# Altium schematic sheet Switch_Matrix_CTRL.schdoc: Switch Matrix 32:2
size 420 x 297 mm; EDA_Number: ARTIQ; Projet: Switch_Matrix; Author: G.Kasprowicz; CompanyName: WUT ISE; DrawnBy: G.Kasprowicz; Organization: WUT ISE; Address1: PW ISE; Address2: Nowowiejska 15/19 00-665 Warsaw; Address3: gkasprow@gmail.com; DocumentNumber: 3; Revision: 2; SheetNumber: 3; SheetTotal: 6; ModifiedBy: -; CheckedDate: -; Title2: SPI extender; DivGrp: WUT ISE; Designer: G.Kasprowicz; ModifiedDate: -; ProjectName: Sensor Box
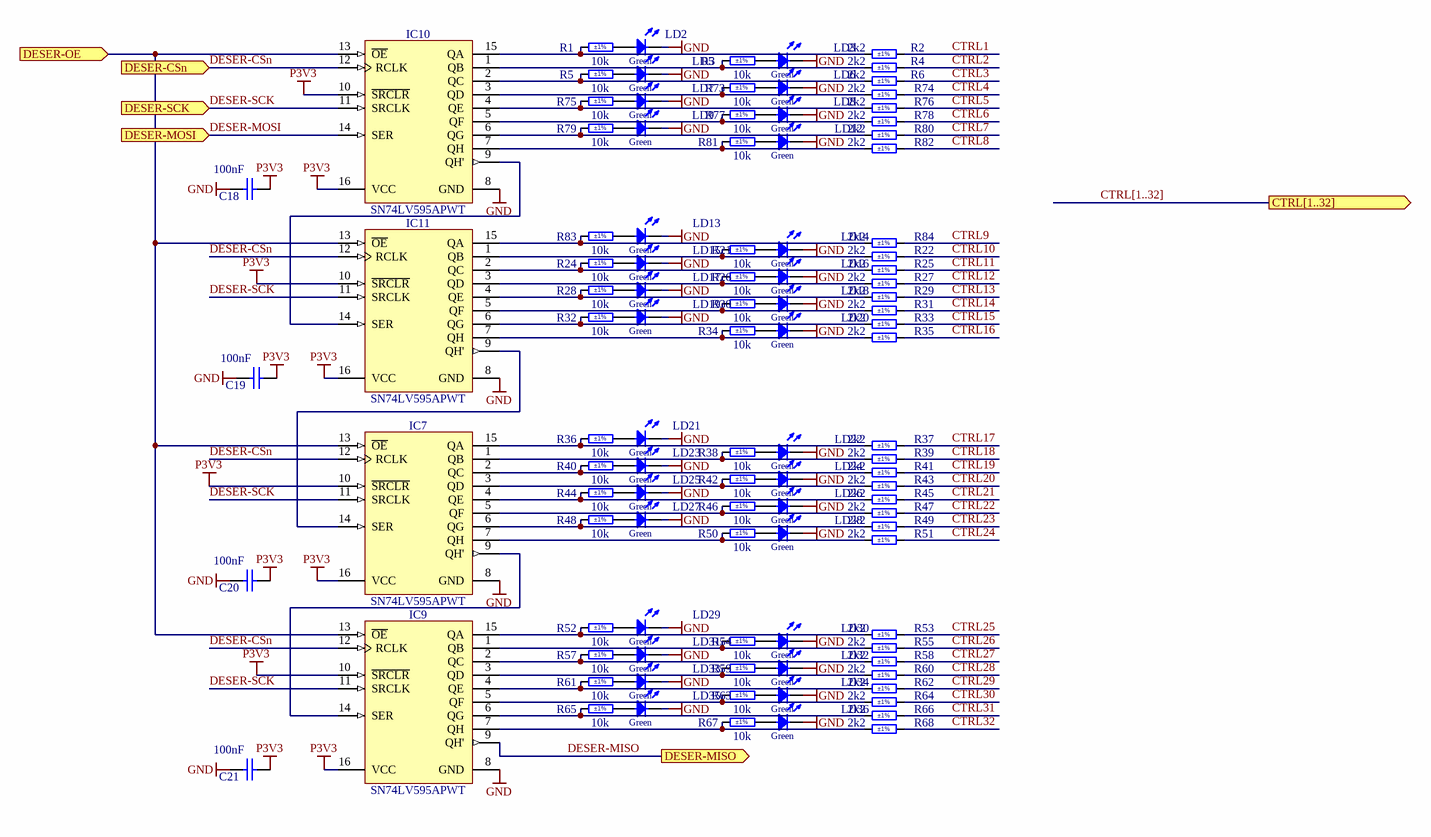
[diagram p0: Switch_Matrix_CTRL.schdoc]

## Parts
C18  100nF  [CAPC1608X87N]
C19  100nF  [CAPC1608X87N]
C20  100nF  [CAPC1608X87N]
C21  100nF  [CAPC1608X87N]
IC7  SN74LV595APWT  [SOP65P640X120-16N]
IC9  SN74LV595APWT  [SOP65P640X120-16N]
IC10  SN74LV595APWT  [SOP65P640X120-16N]
IC11  SN74LV595APWT  [SOP65P640X120-16N]
LD2  Green  [LED_KINGBRIGHT_KP-1608CGCK]
LD3  Green  [LED_KINGBRIGHT_KP-1608CGCK]
LD5  Green  [LED_KINGBRIGHT_KP-1608CGCK]
LD6  Green  [LED_KINGBRIGHT_KP-1608CGCK]
LD7  Green  [LED_KINGBRIGHT_KP-1608CGCK]
LD8  Green  [LED_KINGBRIGHT_KP-1608CGCK]
LD9  Green  [LED_KINGBRIGHT_KP-1608CGCK]
LD12  Green  [LED_KINGBRIGHT_KP-1608CGCK]
LD13  Green  [LED_KINGBRIGHT_KP-1608CGCK]
LD14  Green  [LED_KINGBRIGHT_KP-1608CGCK]
LD15  Green  [LED_KINGBRIGHT_KP-1608CGCK]
LD16  Green  [LED_KINGBRIGHT_KP-1608CGCK]
LD17  Green  [LED_KINGBRIGHT_KP-1608CGCK]
LD18  Green  [LED_KINGBRIGHT_KP-1608CGCK]
LD19  Green  [LED_KINGBRIGHT_KP-1608CGCK]
LD20  Green  [LED_KINGBRIGHT_KP-1608CGCK]
LD21  Green  [LED_KINGBRIGHT_KP-1608CGCK]
LD22  Green  [LED_KINGBRIGHT_KP-1608CGCK]
LD23  Green  [LED_KINGBRIGHT_KP-1608CGCK]
LD24  Green  [LED_KINGBRIGHT_KP-1608CGCK]
LD25  Green  [LED_KINGBRIGHT_KP-1608CGCK]
LD26  Green  [LED_KINGBRIGHT_KP-1608CGCK]
LD27  Green  [LED_KINGBRIGHT_KP-1608CGCK]
LD28  Green  [LED_KINGBRIGHT_KP-1608CGCK]
LD29  Green  [LED_KINGBRIGHT_KP-1608CGCK]
LD30  Green  [LED_KINGBRIGHT_KP-1608CGCK]
LD31  Green  [LED_KINGBRIGHT_KP-1608CGCK]
LD32  Green  [LED_KINGBRIGHT_KP-1608CGCK]
LD33  Green  [LED_KINGBRIGHT_KP-1608CGCK]
LD34  Green  [LED_KINGBRIGHT_KP-1608CGCK]
LD35  Green  [LED_KINGBRIGHT_KP-1608CGCK]
LD36  Green  [LED_KINGBRIGHT_KP-1608CGCK]
R1  10k  Tolerance: ±1%  [RESC1608X55N]
R2  2k2  Tolerance: ±1%  [RESC1608X55N]
R3  10k  Tolerance: ±1%  [RESC1608X55N]
R4  2k2  Tolerance: ±1%  [RESC1608X55N]
R5  10k  Tolerance: ±1%  [RESC1608X55N]
R6  2k2  Tolerance: ±1%  [RESC1608X55N]
R21  10k  Tolerance: ±1%  [RESC1608X55N]
R22  2k2  Tolerance: ±1%  [RESC1608X55N]
R24  10k  Tolerance: ±1%  [RESC1608X55N]
R25  2k2  Tolerance: ±1%  [RESC1608X55N]
R26  10k  Tolerance: ±1%  [RESC1608X55N]
R27  2k2  Tolerance: ±1%  [RESC1608X55N]
R28  10k  Tolerance: ±1%  [RESC1608X55N]
R29  2k2  Tolerance: ±1%  [RESC1608X55N]
R30  10k  Tolerance: ±1%  [RESC1608X55N]
R31  2k2  Tolerance: ±1%  [RESC1608X55N]
R32  10k  Tolerance: ±1%  [RESC1608X55N]
R33  2k2  Tolerance: ±1%  [RESC1608X55N]
R34  10k  Tolerance: ±1%  [RESC1608X55N]
R35  2k2  Tolerance: ±1%  [RESC1608X55N]
R36  10k  Tolerance: ±1%  [RESC1608X55N]
R37  2k2  Tolerance: ±1%  [RESC1608X55N]
R38  10k  Tolerance: ±1%  [RESC1608X55N]
R39  2k2  Tolerance: ±1%  [RESC1608X55N]
R40  10k  Tolerance: ±1%  [RESC1608X55N]
R41  2k2  Tolerance: ±1%  [RESC1608X55N]
R42  10k  Tolerance: ±1%  [RESC1608X55N]
R43  2k2  Tolerance: ±1%  [RESC1608X55N]
R44  10k  Tolerance: ±1%  [RESC1608X55N]
R45  2k2  Tolerance: ±1%  [RESC1608X55N]
R46  10k  Tolerance: ±1%  [RESC1608X55N]
R47  2k2  Tolerance: ±1%  [RESC1608X55N]
R48  10k  Tolerance: ±1%  [RESC1608X55N]
R49  2k2  Tolerance: ±1%  [RESC1608X55N]
R50  10k  Tolerance: ±1%  [RESC1608X55N]
R51  2k2  Tolerance: ±1%  [RESC1608X55N]
R52  10k  Tolerance: ±1%  [RESC1608X55N]
R53  2k2  Tolerance: ±1%  [RESC1608X55N]
R54  10k  Tolerance: ±1%  [RESC1608X55N]
R55  2k2  Tolerance: ±1%  [RESC1608X55N]
R57  10k  Tolerance: ±1%  [RESC1608X55N]
R58  2k2  Tolerance: ±1%  [RESC1608X55N]
R59  10k  Tolerance: ±1%  [RESC1608X55N]
R60  2k2  Tolerance: ±1%  [RESC1608X55N]
R61  10k  Tolerance: ±1%  [RESC1608X55N]
R62  2k2  Tolerance: ±1%  [RESC1608X55N]
R63  10k  Tolerance: ±1%  [RESC1608X55N]
R64  2k2  Tolerance: ±1%  [RESC1608X55N]
R65  10k  Tolerance: ±1%  [RESC1608X55N]
R66  2k2  Tolerance: ±1%  [RESC1608X55N]
R67  10k  Tolerance: ±1%  [RESC1608X55N]
R68  2k2  Tolerance: ±1%  [RESC1608X55N]
R73  10k  Tolerance: ±1%  [RESC1608X55N]
R74  2k2  Tolerance: ±1%  [RESC1608X55N]
R75  10k  Tolerance: ±1%  [RESC1608X55N]
R76  2k2  Tolerance: ±1%  [RESC1608X55N]
R77  10k  Tolerance: ±1%  [RESC1608X55N]
R78  2k2  Tolerance: ±1%  [RESC1608X55N]
R79  10k  Tolerance: ±1%  [RESC1608X55N]
R80  2k2  Tolerance: ±1%  [RESC1608X55N]
R81  10k  Tolerance: ±1%  [RESC1608X55N]
R82  2k2  Tolerance: ±1%  [RESC1608X55N]
R83  10k  Tolerance: ±1%  [RESC1608X55N]
R84  2k2  Tolerance: ±1%  [RESC1608X55N]

## Ports
CTRL[1..32] (out), DESER-CSn (in), DESER-MISO (out), DESER-MOSI (in), DESER-OE (in), DESER-SCK (in)

## Nets
GND: C18.1 C19.1 C20.1 C21.1 IC7.8(GND) IC9.8(GND) IC10.8(GND) IC11.8(GND) LD2.1(C) LD3.1(C) LD5.1(C) LD6.1(C) LD7.1(C) LD8.1(C) LD9.1(C) LD12.1(C) LD13.1(C) LD14.1(C) LD15.1(C) LD16.1(C) LD17.1(C) LD18.1(C) LD19.1(C) LD20.1(C) LD21.1(C) LD22.1(C) LD23.1(C) LD24.1(C) LD25.1(C) LD26.1(C) LD27.1(C) LD28.1(C) LD29.1(C) LD30.1(C) LD31.1(C) LD32.1(C) LD33.1(C) LD34.1(C) LD35.1(C) LD36.1(C)
P3V3: C18.2 C19.2 C20.2 C21.2 IC7.10(~{SRCLR}) IC7.16(VCC) IC9.10(~{SRCLR}) IC9.16(VCC) IC10.10(~{SRCLR}) IC10.16(VCC) IC11.10(~{SRCLR}) IC11.16(VCC)
CTRL1: R2.2
CTRL2: R4.2
CTRL3: R6.2
CTRL4: R74.2
CTRL5: R76.2
CTRL6: R78.2
CTRL7: R80.2
CTRL8: R82.2
CTRL9: R84.2
CTRL10: R22.2
CTRL11: R25.2
CTRL12: R27.2
CTRL13: R29.2
CTRL14: R31.2
CTRL15: R33.2
CTRL16: R35.2
CTRL17: R37.2
CTRL18: R39.2
CTRL19: R41.2
CTRL20: R43.2
CTRL21: R45.2
CTRL22: R47.2
CTRL23: R49.2
CTRL24: R51.2
CTRL25: R53.2
CTRL26: R55.2
CTRL27: R58.2
CTRL28: R60.2
CTRL29: R62.2
CTRL30: R64.2
CTRL31: R66.2
CTRL32: R68.2
DESER-CSn: IC7.12(RCLK) IC9.12(RCLK) IC10.12(RCLK) IC11.12(RCLK) ; port DESER-CSn
DESER-MISO: IC9.9(QH') ; port DESER-MISO
DESER-MOSI: IC10.14(SER) ; port DESER-MOSI
DESER-OE: IC7.13(~{OE}) IC9.13(~{OE}) IC10.13(~{OE}) IC11.13(~{OE}) ; port DESER-OE
DESER-SCK: IC7.11(SRCLK) IC9.11(SRCLK) IC10.11(SRCLK) IC11.11(SRCLK) ; port DESER-SCK
NetIC7_1: IC7.1(QB) R38.1 R39.1
NetIC7_2: IC7.2(QC) R40.1 R41.1
NetIC7_3: IC7.3(QD) R42.1 R43.1
NetIC7_4: IC7.4(QE) R44.1 R45.1
NetIC7_5: IC7.5(QF) R46.1 R47.1
NetIC7_6: IC7.6(QG) R48.1 R49.1
NetIC7_7: IC7.7(QH) R50.1 R51.1
NetIC7_9: IC7.9(QH') IC9.14(SER)
NetIC7_14: IC7.14(SER) IC11.9(QH')
NetIC7_15: IC7.15(QA) R36.1 R37.1
NetIC9_1: IC9.1(QB) R54.1 R55.1
NetIC9_2: IC9.2(QC) R57.1 R58.1
NetIC9_3: IC9.3(QD) R59.1 R60.1
NetIC9_4: IC9.4(QE) R61.1 R62.1
NetIC9_5: IC9.5(QF) R63.1 R64.1
NetIC9_6: IC9.6(QG) R65.1 R66.1
NetIC9_7: IC9.7(QH) R67.1 R68.1
NetIC9_15: IC9.15(QA) R52.1 R53.1
NetIC10_1: IC10.1(QB) R3.1 R4.1
NetIC10_2: IC10.2(QC) R5.1 R6.1
NetIC10_3: IC10.3(QD) R73.1 R74.1
NetIC10_4: IC10.4(QE) R75.1 R76.1
NetIC10_5: IC10.5(QF) R77.1 R78.1
NetIC10_6: IC10.6(QG) R79.1 R80.1
NetIC10_7: IC10.7(QH) R81.1 R82.1
NetIC10_9: IC10.9(QH') IC11.14(SER)
NetIC10_15: IC10.15(QA) R1.1 R2.1
NetIC11_1: IC11.1(QB) R21.1 R22.1
NetIC11_2: IC11.2(QC) R24.1 R25.1
NetIC11_3: IC11.3(QD) R26.1 R27.1
NetIC11_4: IC11.4(QE) R28.1 R29.1
NetIC11_5: IC11.5(QF) R30.1 R31.1
NetIC11_6: IC11.6(QG) R32.1 R33.1
NetIC11_7: IC11.7(QH) R34.1 R35.1
NetIC11_15: IC11.15(QA) R83.1 R84.1
NetLD2_2: LD2.2(A) R1.2
NetLD3_2: LD3.2(A) R3.2
NetLD5_2: LD5.2(A) R5.2
NetLD6_2: LD6.2(A) R73.2
NetLD7_2: LD7.2(A) R75.2
NetLD8_2: LD8.2(A) R77.2
NetLD9_2: LD9.2(A) R79.2
NetLD12_2: LD12.2(A) R81.2
NetLD13_2: LD13.2(A) R83.2
NetLD14_2: LD14.2(A) R21.2
NetLD15_2: LD15.2(A) R24.2
NetLD16_2: LD16.2(A) R26.2
NetLD17_2: LD17.2(A) R28.2
NetLD18_2: LD18.2(A) R30.2
NetLD19_2: LD19.2(A) R32.2
NetLD20_2: LD20.2(A) R34.2
NetLD21_2: LD21.2(A) R36.2
NetLD22_2: LD22.2(A) R38.2
NetLD23_2: LD23.2(A) R40.2
NetLD24_2: LD24.2(A) R42.2
NetLD25_2: LD25.2(A) R44.2
NetLD26_2: LD26.2(A) R46.2
NetLD27_2: LD27.2(A) R48.2
NetLD28_2: LD28.2(A) R50.2
NetLD29_2: LD29.2(A) R52.2
NetLD30_2: LD30.2(A) R54.2
NetLD31_2: LD31.2(A) R57.2
NetLD32_2: LD32.2(A) R59.2
NetLD33_2: LD33.2(A) R61.2
NetLD34_2: LD34.2(A) R63.2
NetLD35_2: LD35.2(A) R65.2
NetLD36_2: LD36.2(A) R67.2

## Buses and harness runs
bus CTRL[1..32] = port CTRL[1..32]

## Notes on the sheet
- Project/Equipment
- Document
- Designer
- Drawn by
- Check.by
- Copyright WUT ISE 2018.
  This documentation describes Open Hardware and is licensed under the CERN OHL v.1.1. You may redistribute and modify this documentation under the terms of the CERN OHL v.1.1. (http://ohwr.org/CERNOHL). This documentation is distributed WITHOUT ANY EXPRESS OR IMPLIED WARRANTY, INCLUDING OF MERCHANTABILITY, SATISFACTORY QUALITY AND FITNESS FOR A PARTICULAR PURPOSE. Please see the CERN OHL v.1.1 for applicable conditions.
- Contact
- File
- Last Mod.
- Print Date
- Sheet
- Size
- A3
- of
- Rev

## Library data of the parts
C18-C21 = CC0603_100NF_50V_10%_X7R: Non-polarised capacitor; Part Description: SMD Multilayer Chip Ceramic Capacitor; Manufacturer: GENERIC; Manufacturer1 Part Number: 223858615649; Voltage: 50V; TC: X7R; Tolerance: ±10%; Part Number: CC0603_100NF_50V_10%_X7R; Component Kind: Standard; Component Type: Standard; Pin Count: 2; Value: 100nF; Status: Preferred; Manufacturer Part Number: CC0603_100NF_50V_10%_X7R; Case: 0603; Mounted: Yes; Socket: No; SMD: Yes; Sense: No; Manufacturer1 Example: PHYCOMP; Manufacturer1 ComponentHeight: 0.87mm; HelpURL: \\cern.ch\dfs\Applications\Altium\Datasheets\CC0603_X7R_PHYCOMP.pdf; Author: CERN DEM JLC; CreateDate: 03.12.2007; LatestRevisionDate: 03.12.2007
IC7 IC9-IC11 = SN74LV595APWT: 8-Bit Shift Register With 3-State Output Register; Manufacturer: TEXAS INSTRUMENTS; PressFit: No; Bonding: No; Part Number: SN74LV595APWT; Component Kind: Standard; Component Type: Standard; Device: SN74LV595APWT; PackageDescription: SOP, 0.65mm pitch; 16 pin, 4.40mm W X 5.00mm L X 1.20mm H body IPC Medium Density; Part Description: 8-Bit Shift Register With 3-State Output Register; Manufacturer Part Number: SN74LV595APWT; Pin Count: 16; Case: TSSOP16; Mounted: Yes; Socket: No; SMD: Yes; Sense: No; ComponentHeight: 1.2mm; Author: CERN DEM JLC; HelpURL: \\cern.ch\dfs\Applications\Altium\Datasheets\SN74LV595APWT.pdf; CreateDate: 10.05.2012; LatestRevisionDate: 10.05.2012
LD2 LD3 LD5-LD9 LD12-LD36 = LED_KINGBRIGHT_KP-1608CGCK: LED Green 1C 2A; Part Description: 1.6x0.8mm SMD Chip Green LED Lamp; PressFit: No; Bonding: No; Part Number: LED_KINGBRIGHT_KP-1608CGCK; Component Kind: Standard; Component Type: Standard; Color: Green; PackageDescription: SMT Green LED, Case 0603, Body L 1.60mm x W 0.80mm x H 1.10mm; Manufacturer: KINGBRIGHT; Manufacturer Part Number: KP-1608CGCK; Pin Count: 2; Case: 0603; Mounted: Yes; Socket: No; SMD: Yes; Sense: No; ComponentHeight: 1.1mm; HelpURL: \\cern.ch\dfs\Applications\Altium\Datasheets\LED_KINGBRIGHT_KP-1608CGCK.pdf; Author: CERN DEM HF; CreateDate: 01.10.2021; LatestRevisionDate: 01.10.2021
R1 R3 R5 R21 R24 R26 R28 R30 R32 R34 R36 R38 R40 R42 R44 R46 R48 R50 R52 R54 R57 R59 R61 R63 R65 R67 R73 R75 R77 R79 R81 R83 = R0603_10K_1%_0.1W_100PPM: Resistor - 1%; Part Description: General Purpose Thick Film Chip Resistor; Manufacturer: GENERIC; Manufacturer1 Part Number: NRC06F1002TRF; Power: 0.1W; TC: ±100ppm/°C; PressFit: No; Part Number: R0603_10K_1%_0.1W_100PPM; Component Kind: Standard; Component Type: Standard; Pin Count: 2; Value: 10k; Status: Preferred; Manufacturer Part Number: R0603_10K_1%_0.1W_100PPM; Case: 0603; Mounted: Yes; Sense: No; Socket: No; SMD: Yes; Manufacturer1 Example: NIC COMPONENT; Manufacturer1 ComponentHeight: 0.55mm; HelpURL: \\cern.ch\dfs\Applications\Altium\Datasheets\R0603_NIC_NRC.pdf; Author: CERN DEM JLC; CreateDate: 03.12.2007; LatestRevisionDate: 13.03.2008
R2 R4 R6 R22 R25 R27 R29 R31 R33 R35 R37 R39 R41 R43 R45 R47 R49 R51 R53 R55 R58 R60 R62 R64 R66 R68 R74 R76 R78 R80 R82 R84 = R0603_2K2_1%_0.1W_100PPM: Resistor - 1%; Part Description: General Purpose Thick Film Chip Resistor; Manufacturer: GENERIC; Manufacturer1 Part Number: NRC06F2201TRF; Power: 0.1W; TC: ±100ppm/°C; PressFit: No; Part Number: R0603_2K2_1%_0.1W_100PPM; Component Kind: Standard; Component Type: Standard; Pin Count: 2; Value: 2k2; Status: Preferred; Manufacturer Part Number: R0603_2K2_1%_0.1W_100PPM; Case: 0603; Mounted: Yes; Sense: No; Socket: No; SMD: Yes; Manufacturer1 Example: NIC COMPONENT; Manufacturer1 ComponentHeight: 0.55mm; HelpURL: \\cern.ch\dfs\Applications\Altium\Datasheets\R0603_NIC_NRC.pdf; Author: CERN DEM JLC; CreateDate: 03.12.2007; LatestRevisionDate: 13.03.2008